# EAGLE board Sensormain_of_Tatebayashi (EAGLE 9.6.2)
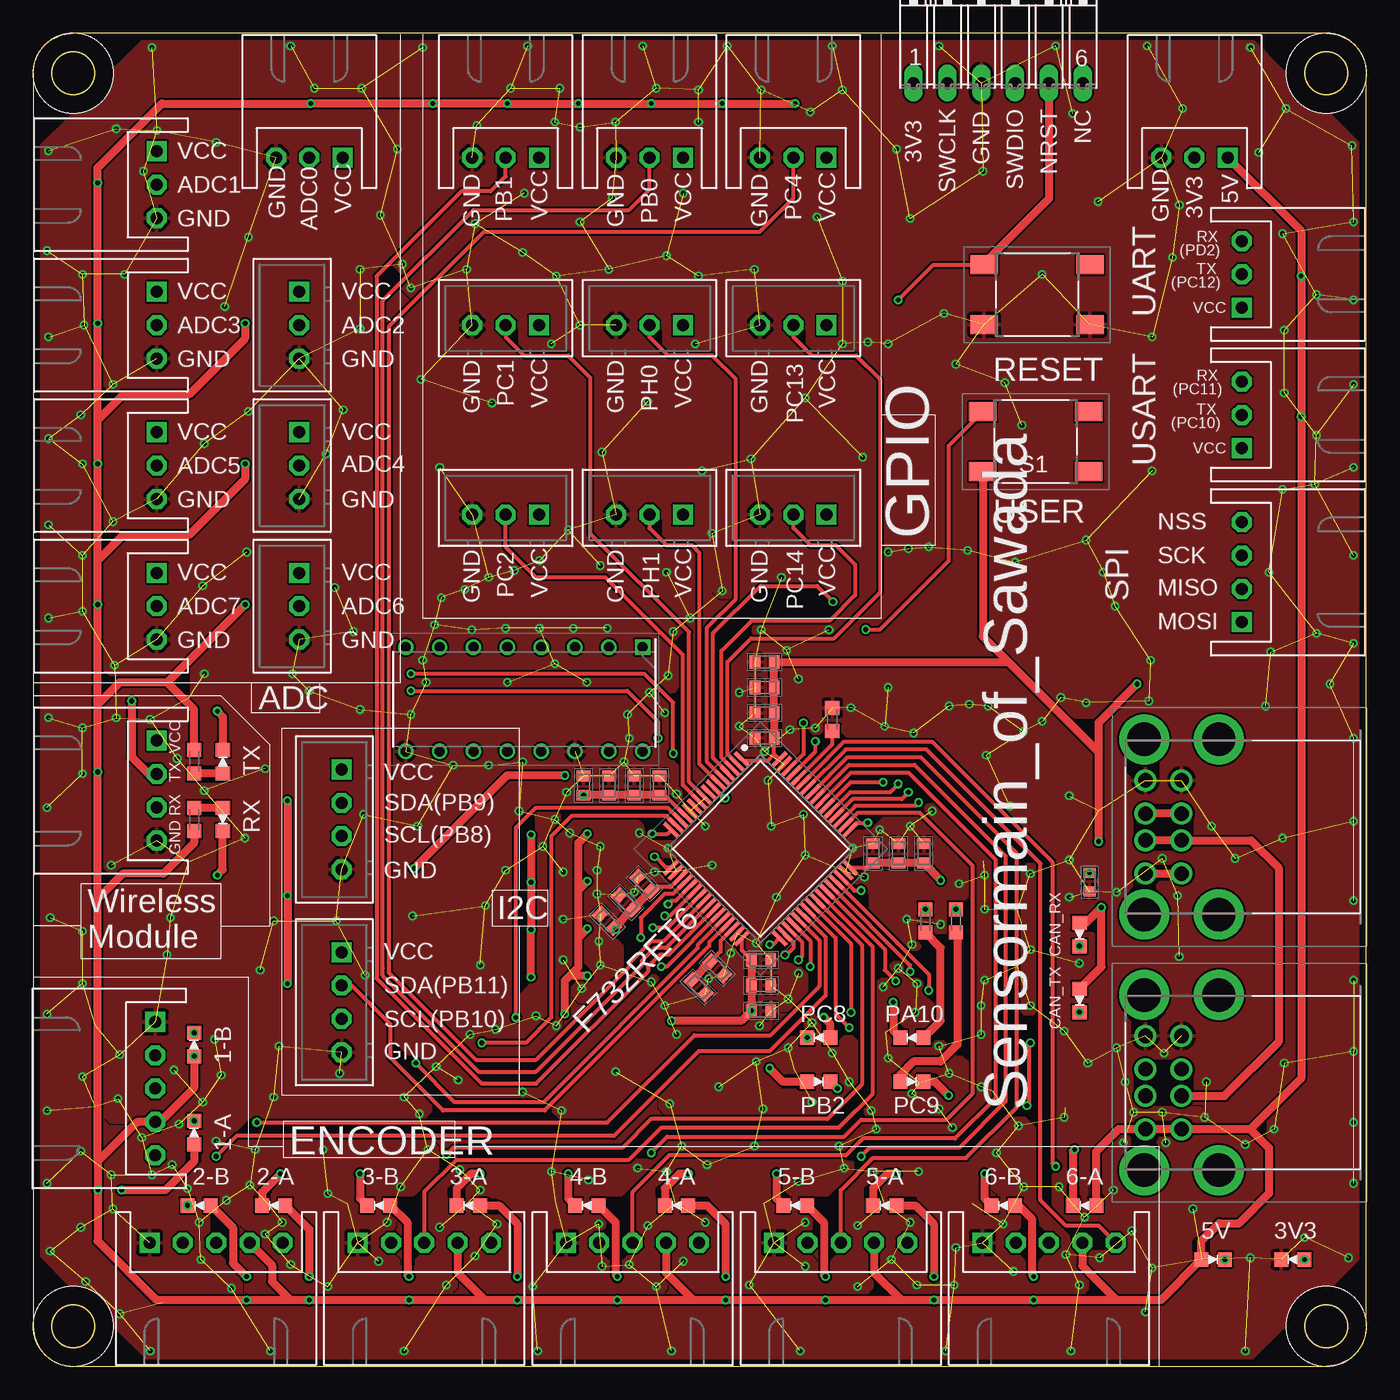
[diagram p5: board, top side]
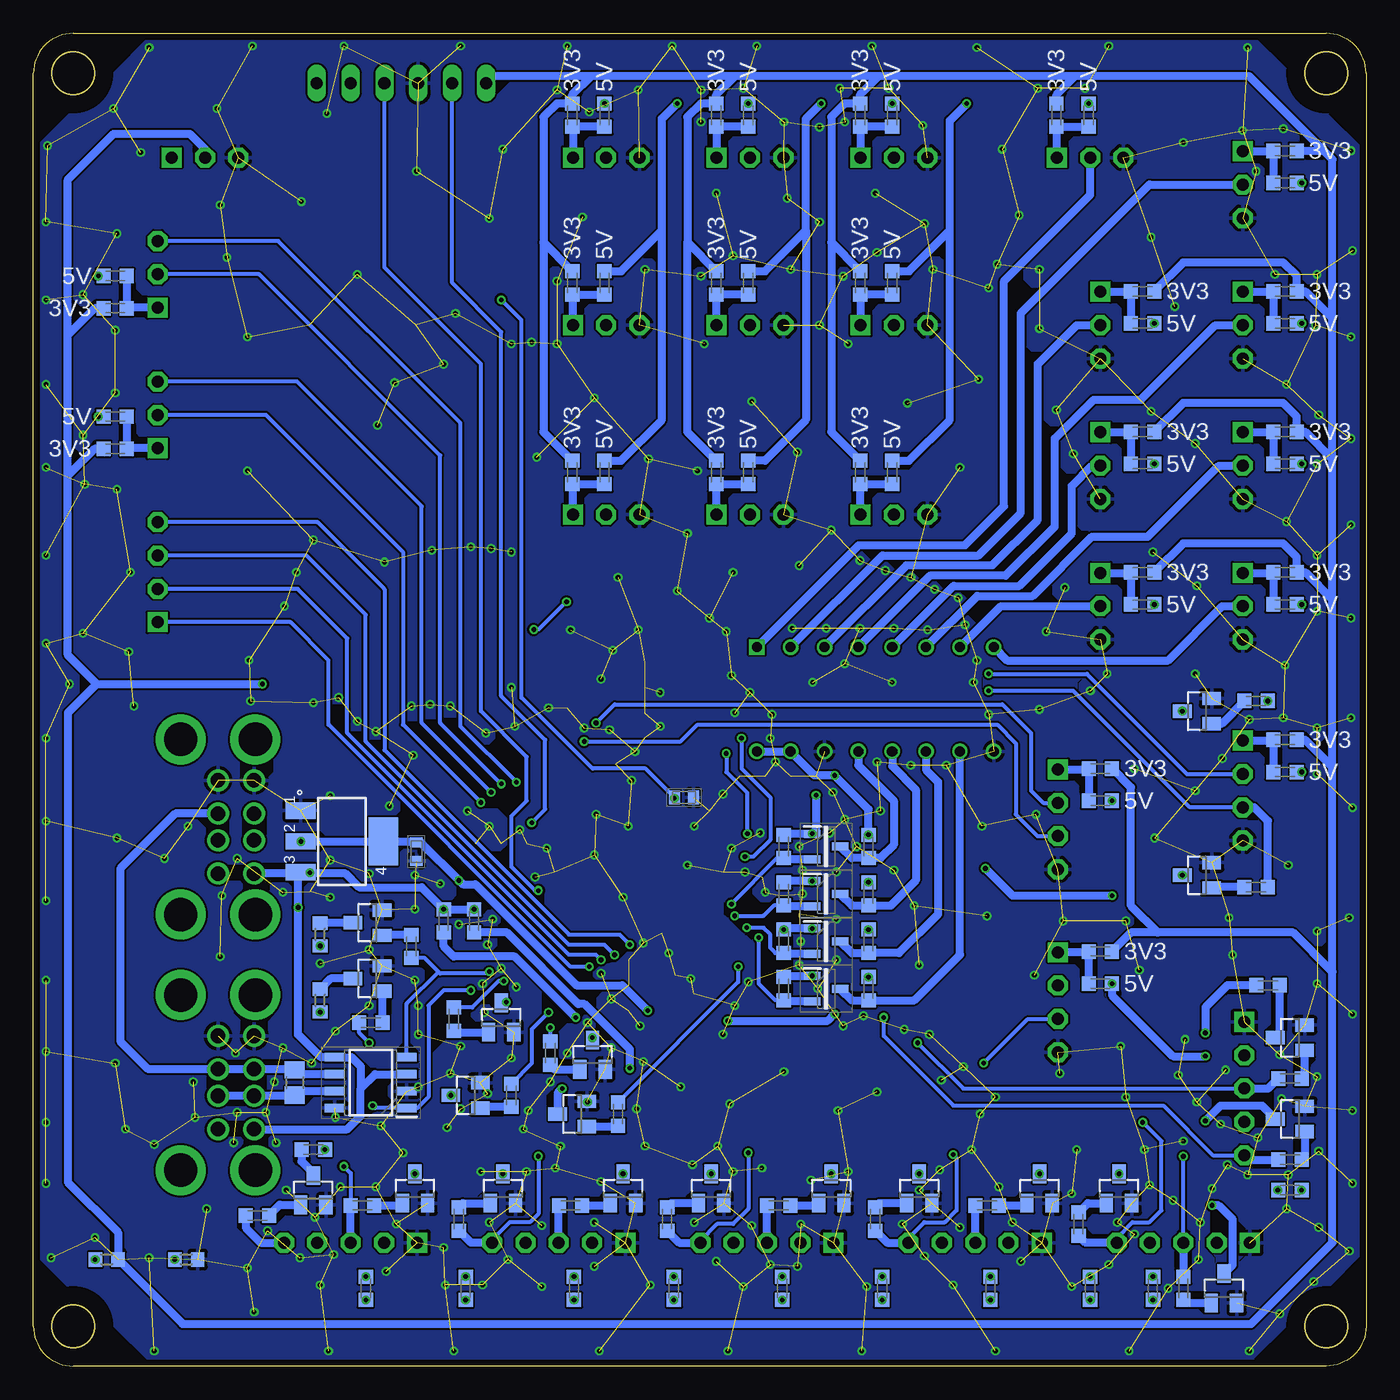
[diagram p6: board, bottom side, seen from below]

Size 100 x 100 mm. Coordinates in mm from the lower left corner, seen from the top.
Outline: 3,0 97,0 arc90 100,3 100,97 arc90 97,100 3,100 arc90 0,97 0,3 arc90 3,0
Outline: circle at 3,3 radius 1.6
Outline: circle at 97,3 radius 1.6
Outline: circle at 97,97 radius 1.6
Outline: circle at 3,97 radius 1.6
Copper layers (1*16): Top 0.035mm / dielectric 1.6mm / Bottom 0.035mm
Design rules "Elecrow_2-layer_PCB_eagle_rule": minimum track width 6mil, minimum drill 12mil, track to track 6mil, track to pad 6mil, pad to pad 6mil, via to via 8mil, smd to smd 0mil, copper to edge 20mil, drill to drill 10mil, minimum pad ring 6mil, minimum via ring 6mil, stop-mask expansion 0mil, vias tented up to drill 100mil, thermal gap 10mil
tRestrict: area 94,94 to 100,100; area 0,94 to 6,100; area 94,0 to 100,6; area 0,0 to 6,6; 323 lines
bRestrict: area 0,0 to 6,6; area 0,94 to 6,100; area 94,94 to 100,100; area 94,0 to 100,6; 480 lines

## Footprints (pad centres in the part's own frame; a part is rotated, then mirrored left to right if it is on the bottom)
CAPC1608X90N = smd 0.75 x 0.94: 1 -0.7,0; 2 0.7,0
CAPC1709X100N = smd 0.81 x 1.04: 1 -0.72,0; 2 0.72,0
QFP50P1200X1200X160-64N = smd 1.475 x 0.3: 1 -5.738,3.75; 2 -5.738,3.25; 3 -5.738,2.75; 4 -5.738,2.25; 5 -5.738,1.75; 6 -5.738,1.25; 7 -5.738,0.75; 8 -5.738,0.25; 9 -5.738,-0.25; 10 -5.738,-0.75; 11 -5.738,-1.25; 12 -5.738,-1.75; 13 -5.738,-2.25; 14 -5.738,-2.75; 15 -5.738,-3.25; 16 -5.738,-3.75; 33 5.738,-3.75; 34 5.738,-3.25; 35 5.738,-2.75; 36 5.738,-2.25; 37 5.738,-1.75; 38 5.738,-1.25; 39 5.738,-0.75; 40 5.738,-0.25; 41 5.738,0.25; 42 5.738,0.75; 43 5.738,1.25; 44 5.738,1.75; 45 5.738,2.25; 46 5.738,2.75; 47 5.738,3.25; 48 5.738,3.75 | smd 0.3 x 1.475: 17 -3.75,-5.738; 18 -3.25,-5.738; 19 -2.75,-5.738; 20 -2.25,-5.738; 21 -1.75,-5.738; 22 -1.25,-5.738; 23 -0.75,-5.738; 24 -0.25,-5.738; 25 0.25,-5.738; 26 0.75,-5.738; 27 1.25,-5.738; 28 1.75,-5.738; 29 2.25,-5.738; 30 2.75,-5.738; 31 3.25,-5.738; 32 3.75,-5.738; 49 3.75,5.738; 50 3.25,5.738; 51 2.75,5.738; 52 2.25,5.738; 53 1.75,5.738; 54 1.25,5.738; 55 0.75,5.738; 56 0.25,5.738; 57 -0.25,5.738; 58 -0.75,5.738; 59 -1.25,5.738; 60 -1.75,5.738; 61 -2.25,5.738; 62 -2.75,5.738; 63 -3.25,5.738; 64 -3.75,5.738
SOIC127P600X175-8N = smd 1.5 x 0.65: 1 -2.7,1.905; 2 -2.7,0.635; 3 -2.7,-0.635; 4 -2.7,-1.905; 5 2.7,-1.905; 6 2.7,-0.635; 7 2.7,0.635; 8 2.7,1.905
DIP781W56P254L1918H533Q16N = drill 0.759 pad 1.159 square: 1 -3.905,8.89 | drill 0.759 pad 1.159: 2 -3.905,6.35; 3 -3.905,3.81; 4 -3.905,1.27; 5 -3.905,-1.27; 6 -3.905,-3.81; 7 -3.905,-6.35; 8 -3.905,-8.89; 9 3.905,-8.89; 10 3.905,-6.35; 11 3.905,-3.81; 12 3.905,-1.27; 13 3.905,1.27; 14 3.905,3.81; 15 3.905,6.35; 16 3.905,8.89
USB4AF203AS = drill 1.1 pad 1.65: 1 0,0; 2 2.5,0; 3 4.5,0; 4 7,0; 5 0,-2.71; 6 2.5,-2.71; 7 4.5,-2.71; 8 7,-2.71 | drill 2.5 pad 3.75: MH1 -3.07,0.09; MH2 10.07,0.09; MH3 -3.07,-5.51; MH4 10.07,-5.51
LED1608 = smd 1.05 x 1.08: A -0.875,0; K 0.875,0
SOT96P237X111-3N = smd 1.25 x 0.6: 1 -1.05,0.955; 2 -1.05,-0.955; 3 1.05,0
SOT-23 = smd 1 x 1.4: 1 -0.95,-1.1; 2 0.95,-1.1; 3 0,1.1
1608 = smd 1.05 x 1.08: 1 -0.875,0; 2 0.875,0
R0603 = smd 1 x 1.1: 1 -0.85,0; 2 0.85,0
SMD1608 = smd 1.05 x 1.08: 1 -0.875,0; 2 0.875,0
R0805 = smd 1.3 x 1.5: 1 -0.95,0; 2 0.95,0
TSHAT25B219E = smd 2.05 x 1.4: A1 -3.975,2.25; B1 3.975,2.25; C1 -3.975,-2.25; D1 3.975,-2.25
06PA = drill 0.914 long: 1 -6.35,0; 2 -3.81,0; 3 -1.27,0; 4 1.27,0; 5 3.81,0; 6 6.35,0
SOT223 = smd 2.235 x 1.219: 1 -3.099,2.311; 2 -3.099,0; 3 -3.099,-2.311 | smd 2.2 x 3.6: 4 3.099,0
S5B-XH-A = drill 0.9 pad 1.5 square: 1 5,0 | drill 0.9 pad 1.5 octagon: 2 2.5,0; 3 0,0; 4 -2.5,0; 5 -5,0
B3B-XH-A = drill 0.9 pad 1.5 square: 1 2.5,0 | drill 0.9 pad 1.5 octagon: 2 0,0; 3 -2.5,0
S4B-XH-A = drill 0.9 pad 1.5 square: 1 3.75,0 | drill 0.9 pad 1.5 octagon: 2 1.25,0; 3 -1.25,0; 4 -3.75,0
S3B-XH-A = drill 0.9 pad 1.5 square: 1 2.5,0 | drill 0.9 pad 1.5 octagon: 2 0,0; 3 -2.5,0
B4B-XH-A = drill 0.9 pad 1.5 square: 1 3.75,0 | drill 0.9 pad 1.5 octagon: 2 1.25,0; 3 -1.25,0; 4 -3.75,0

## Placement (x,y rotation side)
C2  10uF  [CAPC1608X90N]  71.25,38.61 90 bottom
C3  100n  [CAPC1709X100N]  45.09,43.56 270 top
C4  1u  [CAPC1709X100N]  43.18,43.56 270 top
C5  100n  [CAPC1709X100N]  54.86,49.02 0 top
C6  100n  [CAPC1709X100N]  64.9,38.48 270 top
C7  100n  [CAPC1709X100N]  44.45,34.8 315 top
C8  100n  [CAPC1709X100N]  54.61,28.57 180 top
C9  100n  [CAPC1709X100N]  54.61,26.67 180 top
C10  100n  [CAPC1709X100N]  54.86,50.93 0 top
C11  100n  [CAPC1709X100N]  62.99,38.48 270 top
C12  100n  [CAPC1709X100N]  43.05,33.4 315 top
C13  100n  [CAPC1709X100N]  54.86,47.12 0 top
C14  100n  [CAPC1709X100N]  66.8,38.48 270 top
C15  100n  [CAPC1709X100N]  45.85,36.2 315 top
C16  100n  [CAPC1709X100N]  54.61,30.48 180 top
C17  4.7u  [CAPC1709X100N]  54.86,52.83 0 top
C18  100n  [CAPC1709X100N]  46.99,43.56 270 top
C19  1u  [CAPC1709X100N]  41.27,43.56 270 top
C20  2.2u  [CAPC1709X100N]  51.31,29.84 135 top
C21  2.2u  [CAPC1709X100N]  49.91,28.45 135 top
C22  100n  [CAPC1608X90N]  79.25,36.32 90 top
C23  0.1u  [CAPC1709X100N]  51.18,42.67 180 bottom
IC1  STM32F732RET6  [QFP50P1200X1200X160-64N]  54.57,38.82 315 top
IC2  NCV7351D1ER2G  [SOIC127P600X175-8N]  74.68,21.27 180 bottom
IC4  MCP3208-CI_P  [DIP781W56P254L1918H533Q16N]  36.83,50.04 270 top
J1  USB-4AF203AS  [USB4AF203AS]  83.44,36.96 90 top
J2  USB-4AF203AS  [USB4AF203AS]  83.44,17.78 90 top
LED1-G  LED1608  [LED1608]  48.26,12.06 180 top
LED2-R  LED1608  [LED1608]  94.49,8 180 top
LED3-R  LED1608  [LED1608]  88.52,8 0 top
LED4-G  LED1608  [LED1608]  63.88,12.06 180 top
LED5-G  LED1608  [LED1608]  78.87,12.06 180 top
LED6-Y  LED1608  [LED1608]  12.06,24.13 90 top
LED7-Y  LED1608  [LED1608]  12.45,12.06 180 top
LED8-Y  LED1608  [LED1608]  25.91,12.06 180 top
LED9-Y  LED1608  [LED1608]  41.53,12.06 180 top
LED10-Y  LED1608  [LED1608]  57.15,12.06 180 top
LED11-Y  LED1608  [LED1608]  72.77,12.06 180 top
LED12-G  LED1608  [LED1608]  14.22,45.34 90 top
LED13-Y  LED1608  [LED1608]  14.22,41.02 270 top
LED14-B  LED1608  [LED1608]  65.91,24.64 180 top
LED15-B  LED1608  [LED1608]  65.91,21.34 0 top
LED16-B  LED1608  [LED1608]  58.93,24.64 180 top
LED17-B  LED1608  [LED1608]  58.93,21.34 0 top
LED18-G  LED1608  [LED1608]  78.49,27.43 270 top
LED19-Y  LED1608  [LED1608]  78.49,32.38 270 top
LED20-G  LED1608  [LED1608]  12.06,17.53 90 top
LED21-G  LED1608  [LED1608]  18.03,12.06 180 top
LED23-G  LED1608  [LED1608]  32.64,12.06 180 top
Q1  BSS138LT7G  [SOT96P237X111-3N]  40.51,28.32 0 bottom
Q2  BSS138LT7G  [SOT96P237X111-3N]  40.51,31.88 0 bottom
Q3  BSS138LT7G  [SOT96P237X111-3N]  40.51,35.43 0 bottom
Q5  BSS138LT7G  [SOT96P237X111-3N]  40.51,38.99 0 bottom
Q9  SOT-23_NMOS  [SOT-23]  74.93,29.08 90 bottom
Q10  SOT-23_NMOS  [SOT-23]  74.93,33.27 90 bottom
R1  10k  [1608]  59.94,48.51 90 top
R2  1k  [R0603]  94.49,8 180 bottom
R3  1k  [R0603]  88.52,8 0 bottom
R4  10k  [SMD1608]  52.45,11.05 90 bottom
R5  120  [R0805]  80.39,21.29 270 bottom
R6  1k  [SMD1608]  51.94,5.84 90 bottom
R7  10k  [SMD1608]  68.07,11.05 90 bottom
R8  1k  [SMD1608]  67.56,5.84 90 bottom
R9  10k  [SMD1608]  83.19,11.3 0 bottom
R10  1k  [SMD1608]  78.99,16.26 180 bottom
R11  10k  [SMD1608]  5.71,21.59 0 bottom
R12  1k  [SMD1608]  7.37,28.57 0 bottom
R13  10k  [SMD1608]  13.72,5.84 270 bottom
R14  1k  [SMD1608]  16,5.84 90 bottom
R15  10k  [SMD1608]  28.45,12.06 0 bottom
R16  1k  [SMD1608]  28.19,5.84 90 bottom
R17  10k  [SMD1608]  44.07,12.06 0 bottom
R18  1k  [SMD1608]  43.81,5.84 90 bottom
R19  10k  [SMD1608]  59.69,12.06 0 bottom
R20  1k  [SMD1608]  59.44,5.84 90 bottom
R21  10k  [SMD1608]  75.31,12.06 0 bottom
R22  1k  [SMD1608]  75.06,5.84 90 bottom
R23  10k  [SMD1608]  43.69,28.32 270 bottom
R24  10k  [SMD1608]  37.34,28.32 270 bottom
R25  10k  [SMD1608]  43.69,31.88 270 bottom
R26  10k  [SMD1608]  37.34,31.88 270 bottom
R27  10k  [SMD1608]  43.69,35.43 270 bottom
R28  10k  [SMD1608]  37.34,35.43 270 bottom
R29  10k  [SMD1608]  43.69,38.99 270 bottom
R30  10k  [SMD1608]  37.34,38.99 270 bottom
R31  0  [SMD1608]  6.1,46.99 0 bottom
R32  0  [SMD1608]  6.1,44.58 0 bottom
R33  [SMD1608]  6.1,91.19 180 bottom
R34  [SMD1608]  6.1,88.77 180 bottom
R35  [SMD1608]  23.24,93.85 270 bottom
R36  [SMD1608]  20.83,93.85 270 bottom
R37  [SMD1608]  16.76,80.64 180 bottom
R38  [SMD1608]  16.76,78.23 180 bottom
R39  [SMD1608]  6.1,80.64 180 bottom
R40  [SMD1608]  6.1,78.23 180 bottom
R41  [SMD1608]  16.76,70.1 180 bottom
R42  [SMD1608]  16.76,67.69 180 bottom
R43  [SMD1608]  6.1,70.1 180 bottom
R44  [SMD1608]  6.1,67.69 180 bottom
R45  [SMD1608]  16.76,59.56 180 bottom
R46  [SMD1608]  16.76,57.15 180 bottom
R47  10k  [SMD1608]  5.71,15.49 0 bottom
R48  1k  [SMD1608]  5.71,13.21 180 bottom
R49  10k  [SMD1608]  21.59,10.67 90 bottom
R50  1k  [SMD1608]  20.7,5.84 90 bottom
R51  [SMD1608]  6.1,59.56 180 bottom
R52  [SMD1608]  6.1,57.15 180 bottom
R53  10k  [SMD1608]  36.83,11.05 90 bottom
R54  1k  [SMD1608]  36.32,5.84 90 bottom
R55  10k  [SMD1608]  8.26,49.91 180 bottom
R56  1k  [SMD1608]  12.06,45.34 270 top
R57  10k  [SMD1608]  8.26,35.94 180 bottom
R58  1k  [SMD1608]  12.06,41.02 90 top
R59  10k  [SMD1608]  68.45,26.04 270 bottom
R60  1k  [SMD1608]  66.93,33.4 270 top
R61  10k  [SMD1608]  64.14,20.32 270 bottom
R62  1k  [SMD1608]  69.22,33.4 270 top
R63  10k  [SMD1608]  61.21,23.5 270 bottom
R64  1k  [SMD1608]  69.22,33.4 270 bottom
R65  10k  [SMD1608]  56.13,18.92 270 bottom
R66  1k  [SMD1608]  66.93,33.4 270 bottom
R67  0  [SMD1608]  19.94,31.11 0 bottom
R68  0  [SMD1608]  19.94,28.7 0 bottom
R69  0  [SMD1608]  19.94,44.83 0 bottom
R70  0  [SMD1608]  19.94,42.42 0 bottom
R71  0  [SMD1608]  93.85,68.83 180 bottom
R72  0  [SMD1608]  93.85,71.25 180 bottom
R73  0  [SMD1608]  93.85,79.38 180 bottom
R74  0  [SMD1608]  93.85,81.79 180 bottom
R75  1k  [R0603]  78.49,27.43 90 bottom
R76  1k  [R0603]  78.49,32.38 90 bottom
R77  10k  [SMD1608]  74.68,25.78 180 bottom
R78  10k  [SMD1608]  71.63,31.5 270 bottom
R81  [SMD1608]  37.97,81.28 270 bottom
R82  [SMD1608]  35.56,81.28 270 bottom
R85  [SMD1608]  37.97,67.06 270 bottom
R86  [SMD1608]  35.56,67.06 270 bottom
R87  [SMD1608]  59.56,93.85 270 bottom
R88  [SMD1608]  57.15,93.85 270 bottom
R89  [SMD1608]  48.77,93.85 270 bottom
R90  [SMD1608]  46.35,93.85 270 bottom
R91  [SMD1608]  37.97,93.85 270 bottom
R92  [SMD1608]  35.56,93.85 270 bottom
R95  [SMD1608]  48.77,81.28 270 bottom
R96  [SMD1608]  46.35,81.28 270 bottom
R97  [SMD1608]  48.77,67.06 270 bottom
R98  [SMD1608]  46.35,67.06 270 bottom
R99  [SMD1608]  59.56,81.28 270 bottom
R100  [SMD1608]  57.15,81.28 270 bottom
R101  [SMD1608]  59.56,67.06 270 bottom
R102  [SMD1608]  57.15,67.06 270 bottom
S1  TSHA-T-2.5B2-19E  [TSHAT25B219E]  75.21,69.37 0 top
S2  TSHA-T-2.5B2-19E  [TSHAT25B219E]  75.31,80.39 0 top
SL1  [06PA]  72.39,96.27 0 top
TR1  2SC2712GR  [SOT-23]  49.15,13.34 0 bottom
TR2  2SC2712GR  [SOT-23]  64.77,13.34 0 bottom
TR3  2SC2712GR  [SOT-23]  78.99,13.21 0 bottom
TR4  2SC2712GR  [SOT-23]  5.71,24.64 90 bottom
TR5  2SC2712GR  [SOT-23]  10.67,5.84 0 bottom
TR6  2SC2712GR  [SOT-23]  24.51,13.34 0 bottom
TR7  2SC2712GR  [SOT-23]  40.13,13.34 0 bottom
TR8  2SC2712GR  [SOT-23]  55.75,13.34 0 bottom
TR9  2SC2712GR  [SOT-23]  71.37,13.34 0 bottom
TR10  2SC2712GR  [SOT-23]  12.7,49.15 90 bottom
TR11  2SC2712GR  [SOT-23]  12.7,36.83 90 bottom
TR12  2SC2712GR  [SOT-23]  64.9,26.16 0 bottom
TR13  2SC2712GR  [SOT-23]  67.56,20.32 90 bottom
TR14  2SC2712GR  [SOT-23]  58.04,23.37 0 bottom
TR15  2SC2712GR  [SOT-23]  5.71,18.54 90 bottom
TR16  2SC2712GR  [SOT-23]  18.54,13.34 0 bottom
TR17  2SC2712GR  [SOT-23]  59.56,18.92 90 bottom
TR21  2SC2712GR  [SOT-23]  33.53,13.34 0 bottom
U1  LD1117S33CTR  [SOT223]  76.83,39.37 0 bottom
X1  S5B-XH-A  [S5B-XH-A]  9.14,20.83 90 top
X2  S5B-XH-A  [S5B-XH-A]  13.72,9.27 180 top
X3  S5B-XH-A  [S5B-XH-A]  29.34,9.27 180 top
X4  S5B-XH-A  [S5B-XH-A]  44.96,9.27 180 top
X5  S5B-XH-A  [S5B-XH-A]  60.58,9.27 180 top
X6  S5B-XH-A  [S5B-XH-A]  76.2,9.27 180 top
X7  B3B-XH-A  [B3B-XH-A]  19.94,78.11 90 top
X8  S4B-XH-A  [S4B-XH-A]  90.68,59.56 270 top
X9  S4B-XH-A  [S4B-XH-A]  9.27,43.18 90 top
X10  B3B-XH-A  [B3B-XH-A]  19.94,67.56 90 top
X11  S3B-XH-A  [S3B-XH-A]  90.68,81.92 270 top
X12  S3B-XH-A  [S3B-XH-A]  20.7,90.68 0 top
X13  S3B-XH-A  [S3B-XH-A]  90.68,71.37 270 top
X14  B4B-XH-2  [B4B-XH-A]  23.11,41.02 90 top
X17  B4B-XH-2  [B4B-XH-A]  23.11,27.3 90 top
X18  S3B-XH-A  [S3B-XH-A]  9.27,67.56 90 top
X20  B3B-XH-A  [B3B-XH-A]  19.94,57.02 90 top
X21  S3B-XH-A  [S3B-XH-A]  9.27,57.02 90 top
X22  S3B-XH-A  [S3B-XH-A]  87.12,90.68 0 top
X23  S3B-XH-A  [S3B-XH-A]  9.27,78.11 90 top
X24  B3B-XH-A  [B3B-XH-A]  35.43,78.11 0 top
X25  S3B-XH-A  [S3B-XH-A]  9.27,88.65 90 top
X27  B3B-XH-A  [B3B-XH-A]  35.43,63.88 0 top
X28  S3B-XH-A  [S3B-XH-A]  57.02,90.68 0 top
X29  S3B-XH-A  [S3B-XH-A]  46.23,90.68 0 top
X30  S3B-XH-A  [S3B-XH-A]  35.43,90.68 0 top
X32  B3B-XH-A  [B3B-XH-A]  46.23,78.11 0 top
X33  B3B-XH-A  [B3B-XH-A]  46.23,63.88 0 top
X34  B3B-XH-A  [B3B-XH-A]  57.02,78.11 0 top
X35  B3B-XH-A  [B3B-XH-A]  57.02,63.88 0 top

## Tracks (layer width: path | path; a pad name or v marks a point on that pad's centre or on a via)
3V3  (via drill 0.35)
  Top 0.305: IC1.19 47.8,35.94 46.61,35.94 C15.2 | IC1.64 55.58,45.93 | 55.58,45.93 55.58,46.86 C13.2 | IC1.1 53.29,45.41 55.06,45.41 55.58,45.93 | IC1.48 62.65,37.42 C11.2 | C16.2 53.17,31.2 IC1.32 | IC1.13 47.37,42.84 C18.2
  Top 0.61: C15.2 C7.2 C12.2 43.56,32.88 R25.1 | C16.2 C8.2 C9.2 53.13,25.91 v47.88,25.91 | C11.2 C6.2 C14.2 68.07,36.49 v68.07,36.45 | 55.58,46.86 C5.2 C10.2 C17.2 73.15,52.83 | C18.2 C3.2 C4.2 C19.2 | Q5.1 40.89,39.27 40.89,35.72 | 40.89,32.16 40.89,29.95 40.23,29.28 | 40.89,32.16 40.89,35.72 | Q3.1 40.89,35.72 | Q2.1 40.89,32.16 | v39.88,26.42 39.88,28.93 40.23,29.28 | Q1.1 40.23,29.28 | 79.93,46.05 74.68,51.31 73.6,52.39 73.15,52.83 | U1.2 79.93,46.05 | 79.93,46.05 79.93,48.31 v82.8,51.18 | S1.C1 71.23,54.75 73.15,52.83
  Bottom 0.61: R29.1 43.61,39.94 Q5.1 41.27,40.23 C19.2 | R23.1 43.61,29.28 Q1.1 | Q2.1 43.61,32.83 R25.1 | Q3.1 43.61,36.39 R27.1 | 97.41,66.8 97.41,53.34 95.25,51.18 | 97.41,66.8 97.41,77.34 | 97.41,77.34 97.41,89.03 93.98,92.46 88.27,92.46 87.12,91.31 X22.2 | R73.2 95.38,79.38 97.41,77.34 | R71.2 95.38,68.83 97.41,66.8 | SL1.1 65.53,96.77 58.17,96.77 | v47.88,25.91 40.39,25.91 v39.88,26.42 | C9.2 55.8,28.57 59.26,28.57 66.83,36.15 67.77,36.15 v68.07,36.45 70.93,39.31 C2.2 71.31,39.37 U1.4 U1.2 | 95.25,51.18 97.41,49.02 97.41,13.8 93.64,10.03 R2.1 88.81,3.17 8.64,3.17 2.54,9.27 2.54,29.59 | 95.25,51.18 v82.8,51.18 | 2.54,29.59 2.54,44.96 | 2.54,44.96 2.54,57.53 | 2.54,57.53 2.54,68.07 | 2.54,68.07 2.54,78.61 | 2.54,78.61 2.54,90.55 3.17,91.19 | 21.84,96.77 8.76,96.77 3.17,91.19 | 21.84,96.77 36.58,96.77 | 36.58,96.77 47.37,96.77 | 47.37,96.77 58.17,96.77 | R31.2 4.57,46.99 2.54,44.96 | 2.54,57.53 4.57,59.56 R51.1 5.22,60.72 6.22,61.72 13.73,61.72 R45.1 | 2.54,68.07 4.57,70.1 R43.1 5.22,71.26 6.22,72.26 13.73,72.26 R41.1 | 2.54,78.61 4.57,80.64 R39.1 5.22,81.8 6.22,82.8 13.73,82.8 R37.1 | R33.1 3.17,91.19 | R35.1 23.24,95.38 21.84,96.77 | 36.58,96.77 37.97,95.38 R91.1 39.13,94.73 40.13,93.73 40.13,84.31 | 47.37,96.77 48.77,95.38 R89.1 49.92,94.73 50.93,93.73 50.93,84.31 | 58.17,96.77 59.56,95.38 R87.1 60.72,94.73 61.72,93.73 61.72,84.31 | R67.2 17.65,32.53 15.63,32.53 | R69.2 17.65,43.43 17.65,34.54 15.63,32.53 | 2.54,29.59 5.47,32.53 15.63,32.53 | R99.1 61.72,84.31 | 50.93,84.31 R95.1 | R81.1 40.13,84.31 | 40.13,84.31 40.13,70.09 R85.1 | R97.1 50.93,70.09 50.93,84.31 | 61.72,84.31 61.72,70.09 R101.1
  other vias: 41.56,29.28 41.56,39.94 41.56,32.83 41.56,36.39 43.69,32.75 41.27,42.84 53.89,26.67 79.93,39.37
5V  (via drill 0.35)
  Top 0.61: J1.1 J1.5 | 91.31,17.78 J2.5 J2.1 81.41,17.78 79.74,16.11 LED5-G.A | 91.31,17.78 95.12,21.59 v95.12,71.25 v95.12,81.79 95.12,85.18 X22.1 | 91.31,17.78 92.71,16.38 92.71,12.95 90.49,10.73 88.96,10.73 87.64,9.41 LED3-R.A 84.6,4.95 81.28,4.95 | 81.28,4.95 v75.06,4.95 v67.56,4.95 65.15,4.95 | 65.15,4.95 v59.44,4.95 v51.94,4.95 49.53,4.95 | 49.53,4.95 v43.81,4.95 v36.32,4.95 33.91,4.95 | 33.91,4.95 v28.19,4.95 v20.7,4.95 19.3,4.95 | 19.3,4.95 16,4.95 | 16,4.95 9.27,4.95 4.83,9.4 4.83,13.19 R48.1 4.83,13.22 4.83,15.37 | X6.4 78.7,7.53 81.28,4.95 | 4.83,15.37 7.79,18.33 X1.4 9.53,18.33 12.06,20.87 LED6-Y.A | X5.4 63.08,7.03 65.15,4.95 | X4.4 47.46,7.03 49.53,4.95 | X3.4 31.84,7.03 33.91,4.95 | R14.1 16,4.95 | X2.4 17.91,7.58 17.91,6.35 19.3,4.95 | R88.1 v51.69,94.73 R90.1 v40.89,94.73 R92.1 v29.97,94.73 R36.1 9.64,94.73 4.83,89.92 v4.83,88.77 v4.83,78.23 4.83,70.99 | R24.1 R26.1 R28.1 R30.1 | 4.83,15.37 4.83,35.05 | 4.83,35.05 v4.83,44.58 4.83,49.66 | 4.83,49.66 v4.83,57.15 4.83,60.45 | 4.83,60.45 v4.83,67.69 4.83,70.99 | R56.1 12.06,49.28 10.03,51.31 | 10.03,51.31 6.48,51.31 4.83,49.66 | R58.1 12.06,39.24 9.78,36.96 6.73,36.96 4.83,35.05 | R46.1 15.88,57.15 10.03,51.31 | R42.1 15.89,66.55 11.7,62.36 6.73,62.36 4.83,60.45 | R38.1 15.89,77.1 11.68,72.9 6.73,72.9 4.83,70.99 | R70.2 v19.06,35.31 R68.2 | v39.88,44.32 35.56,44.32 v28.57,37.34 | LED19-Y.A 78.98,33.26 v80.14,34.42 80.14,29.96 LED18-G.A
  Bottom 0.61: R22.1 v75.06,4.95 | R8.1 v67.56,4.95 | R20.1 v59.44,4.95 | R6.1 v51.94,4.95 | R18.1 v43.81,4.95 | R54.1 v36.32,4.95 | R16.1 v28.19,4.95 | R50.1 v20.7,4.95 | 80.01,36.96 76.58,36.96 75.55,35.93 70.87,35.93 R64.1 R66.1 | 80.01,36.96 J1.1 | v95.12,71.25 R72.2 | R74.2 v95.12,81.79 | IC4.16 IC4.15 43.18,46.1 41.4,44.32 v39.88,44.32 37.34,41.78 R30.1 | v4.83,88.77 R34.1 | R40.1 v4.83,78.23 | R44.1 v4.83,67.69 | R52.1 v4.83,57.15 | R32.2 v4.83,44.58 | R68.2 19.06,27.83 14.49,23.25 LED6-Y.A | R100.1 55.89,82.16 52.83,85.22 | 52.83,85.22 52.83,93.6 51.7,94.73 v51.69,94.73 | R96.1 45.1,82.16 42.04,85.22 | v40.89,94.73 42.04,93.58 42.04,85.22 | R82.1 34.3,82.16 31.24,85.22 | v29.97,94.73 31.24,93.46 31.24,85.22 | R86.1 34.3,67.93 31.24,70.99 31.24,85.22 | 42.04,85.22 42.04,70.99 45.1,67.93 R98.1 | R102.1 55.89,67.93 52.83,70.99 52.83,85.22 | v28.57,37.34 26.54,35.31 v19.06,35.31 | C22.2 79.28,37.06 U1.3 80.01,36.98 80.01,36.96 | 80.01,36.96 80.14,36.83 v80.14,34.42 80.14,24.89 78.42,23.18 IC2.5 76.14,23.18 75.44,22.48 75.44,20.83 | 75.44,20.83 75.44,18.8 76.45,17.78 J2.1 | 75.44,20.83 74.36,21.91 IC2.3
  other vias: 16,4.97 4.84,13.21 66.93,34.28 69.22,34.28 37.34,29.2 37.34,32.75 37.34,36.31 37.34,39.86 57.15,94.73 46.35,94.73 35.56,94.73 20.83,94.73 15.89,57.15 15.89,67.69 15.89,78.23 12.06,23.25 19.06,42.42 19.06,28.7 79.25,37.02
ADC0
  Bottom 0.61: IC4.1 38.07,61.59 30.1,61.59 27.18,64.52 27.18,81.41 20.7,87.88 X12.2
ADC1
  Bottom 0.61: IC4.2 36.29,60.83 29.08,60.83 25.91,64.01 25.91,78.99 16.26,88.65 X25.2
ADC2
  Bottom 0.61: IC4.3 34.51,60.07 28.07,60.07 24.64,63.5 24.64,75.18 21.72,78.11 X7.2
ADC3
  Bottom 0.61: X23.2 11.3,78.11 16.89,72.52 20.45,72.52 23.37,69.6 23.37,62.99 27.05,59.31 32.73,59.31 IC4.4
ADC4
  Bottom 0.61: IC4.5 30.96,58.55 26.04,58.55 22.1,62.48 22.1,66.04 20.57,67.56 X10.2
ADC5
  Bottom 0.61: X18.2 11.05,67.56 16.38,62.23 20.57,62.23 25.02,57.78 29.18,57.78 IC4.6
ADC6
  Bottom 0.61: IC4.7 27.4,57.02 X20.2
ADC7
  Bottom 0.61: IC4.8 26.96,52.96 14.86,52.96 10.79,57.02 X21.2
CAN_RX  (via drill 0.35)
  Top 0.305: v65.79,29.59 65.79,30.09 IC1.44
  Bottom 0.305: IC2.4 71.98,27.21 69.6,29.59 | v65.79,29.59 65.91,29.46 69.47,29.46 69.6,29.59 | 69.6,29.59 70.63,30.62 R78.2
CAN_TX  (via drill 0.35)
  Top 0.305: IC1.45 64.83,31.75 67.18,29.39 v67.18,28.19 | v74.8,24.26 74.68,24.13 74.68,19.68 v74.55,19.56
  Bottom 0.305: v67.18,28.19 69.22,28.19 70.36,27.05 70.36,20.19 71.18,19.37 IC2.1 74.36,19.37 v74.55,19.56 | v74.8,24.26 75.55,25 R77.2
CANH
  Top 0.61: J1.2 J1.6 91.35,39.46 93.47,37.34 93.47,24.38 89.37,20.28 J2.6
  Bottom 0.61: IC2.7 80.09,20.64 R5.2 80.45,20.28 J2.2 J2.6
CANL
  Top 0.61: J1.7 J1.3
  Bottom 0.61: IC2.6 80.06,21.91 R5.1 80.44,22.28 J2.3 J2.7 91.37,22.28 93.47,24.38 93.47,37.34 89.35,41.46 J1.7
ENCODER1-A  (via drill 0.35)
  Top 0.305: IC1.14 47.63,41.88 37.69,41.88 36.2,40.39 v36.2,26.16
  Bottom 0.305: X1.5 11.51,15.83 15.24,19.55 30.98,19.55 36.2,24.77 v36.2,26.16
  Bottom 0.61: X1.5 8.81,15.49 R47.1
ENCODER1-B  (via drill 0.35)
  Top 0.305: IC1.15 47.52,41.27 40.39,41.27 38.86,39.75 38.86,26.16 36.96,24.26 v33.66,24.26
  Bottom 0.305: v33.66,24.26 30.23,20.83 X1.3
  Bottom 0.61: X1.3 7.35,20.83 R11.1
ENCODER2-A  (via drill 0.35)
  Top 0.305: IC1.37 58.98,31.94 58.98,28.5 55.31,24.83 49.59,24.83 43.05,18.29 v16.76,18.29
  Bottom 0.305: X2.5 18.72,9.61 17.53,10.79 16.26,10.79 15.37,11.68 15.37,16.89 v16.76,18.29
  Bottom 0.61: X2.5 21.07,9.27 R49.1
ENCODER2-B  (via drill 0.35)
  Top 0.305: IC1.38 59.44,32.19 59.44,27.81 55.24,23.62 49.91,23.62 43.56,17.27 15.24,17.27 v13.72,15.75
  Bottom 0.305: X2.3 v13.72,15.75
  Bottom 0.61: X2.3 R13.1
ENCODER3-A  (via drill 0.35)
  Top 0.305: IC1.41 62.15,31.6 62.15,21.13 59.56,18.54 46.35,18.54 44.2,16.38 31.5,16.38 v30.99,15.88
  Bottom 0.305: X3.5 34.34,9.61 33.15,10.79 31.62,10.79 30.73,11.68 30.73,15.62 v30.99,15.88
  Bottom 0.61: R53.1 35.93,9.27 X3.5
ENCODER3-B
  Top 0.305: IC1.42 62.99,31.46 62.99,20.45 60.45,17.91 47.12,17.91 44.7,15.49 31.75,15.49 29.34,13.08 X3.3
  Bottom 0.61: X3.3 29.34,12.05 R15.1
ENCODER4-A  (via drill 0.35)
  Top 0.305: IC1.50 61.87,41.53 66.49,41.53 70.45,37.57 70.45,20.42 68.52,18.49 62.1,18.49 60.82,17.21 47.56,17.21 v46.35,16
  Bottom 0.305: v46.35,16 46.35,11.81 47.5,10.67 48.69,10.67 49.96,9.4 X4.5
  Bottom 0.61: R4.1 51.55,9.27 X4.5
ENCODER4-B
  Top 0.305: IC1.55 61.34,44.53 65.66,44.53 72.18,38.01 72.18,20.11 69.15,17.08 62.23,17.08 60.96,15.81 47.69,15.81 44.96,13.08 X4.3
  Bottom 0.61: X4.3 44.94,9.29 R17.1
ENCODER5-A  (via drill 0.35)
  Top 0.305: IC1.56 61.21,45.11 66.11,45.11 72.95,38.27 72.95,19.86 69.47,16.38 62.74,16.38 v62.1,15.75
  Bottom 0.305: X5.5 65.58,9.48 64.26,10.79 62.74,10.79 62.1,11.43 v62.1,15.75
  Bottom 0.61: X5.5 67.17,9.27 R7.1
ENCODER5-B
  Top 0.305: IC1.57 61.09,45.7 66.55,45.7 73.79,38.46 73.79,19.43 69.98,15.62 62.99,15.62 60.58,13.21 X5.3
  Bottom 0.61: X5.3 60.58,12.05 R19.1
ENCODER6-A
  Top 0.305: X6.5 79.93,10.54 77.47,10.54 75.56,12.45 75.56,37.71 66.99,46.28 60.97,46.28 IC1.58
  Bottom 0.61: R9.1 84.06,10.4 82.93,9.27 X6.5
ENCODER6-B  (via drill 0.35)
  Top 0.305: IC1.59 58.42,44.44 58.42,44.45 60.83,46.86 67.44,46.86 76.45,37.85 76.45,15.24 v76.71,14.99
  Bottom 0.305: v76.71,14.99 v76.71,15 76.19,14.48 R21.1
  Bottom 0.61: X6.3 R21.1
GND  (via drill 0.35)  (533 unrouted)
  other vias: 1.27,8.64 3.94,6.35 6.48,3.94 8.76,1.14 17.78,1.14 27.81,1.14 37.85,1.14 47.88,1.14 57.53,1.14 68.45,1.14 77.85,1.14 99.06,13.72 99.06,18.29 99.06,23.62 99.06,28.96 99.06,34.92 99.06,40.89 99.06,47.12 99.06,54.23 99.06,60.83 99.06,67.44 99.06,73.66 99.06,80.01 99.06,85.85 98.93,91.57 93.98,94.36 91.31,98.93 83.57,99.06 76.71,99.06 67.94,99.06 1.02,26.42 1.02,19.18 1.02,13.72 5.97,11.81 12.57,8 12.45,10.79 11.56,13.34 13.72,16.89 5.84,14.35 8.89,14.35 10.41,15.11 8.13,17.14 10.92,18.16 12.7,19.81 18.41,24 13.59,24.51 10.54,22.23 6.35,20.07 6.48,23.37 14.86,5.84 17.4,9.91 19.3,7.62 22.1,5.97 18.67,10.79 14.48,12.45 16.64,16.26 21.72,16.26 29.59,16.26 47.75,19.68 22.1,12.95 27.56,13.46 30.48,10.41 26.54,10.79 25.91,7.87 30.99,6.1 33.15,8.26 34.8,10.67 33.53,13.21 32,14.73 38.86,14.61 41.66,13.97 45.34,14.86 42.42,10.67 42.67,7.49 44.7,7.62 46.1,10.54 46.74,5.97 48.77,7.87 50.42,10.79 53.72,6.1 37.47,5.97 47.5,14.61 50.55,15.11 60.83,14.86 57.4,13.84 57.91,10.79 57.91,7.49 61.85,5.97 61.85,10.54 62.99,14.61 65.79,10.79 64.39,8 66.29,6.1 66.42,14.61 69.22,8.89 69.09,6.1 72.77,10.67 72.26,16 73.91,18.03 74.3,13.46 77.47,8.38 78.49,6.1 73.53,7.11 80.01,8.13 76.96,13.46 77.34,25.15 81.92,21.34 82.55,19.05 78.87,11.18 81.79,16.76 84.96,16.76 81.03,13.21 82.42,10.16 83.95,7.37 90.93,16.64 87.88,18.67 85.98,30.73 85.85,35.31 84.71,38.1 90.17,38.1 93.73,39.62 93.73,65.79 93.85,77.72 93.73,84.96 85.98,87.12 86.23,94.36 77.98,93.98 75.69,81.92 77.72,35.18 62.87,19.18 67.94,19.3 68.71,21.97 64.14,23.11 67.94,24 66.17,26.54 63.75,28.45 66.29,28.7 65.91,31.62 64.9,29.84 48.64,16.51 54.1,16.51 60.45,16.51 63.25,17.78 68.96,17.91 71.12,20.95 71.12,24.89 71.12,27.05 71.37,28.96 65.91,20.45 65.53,33.53 68.07,33.15 65.79,40.51 61.47,38.86 63.5,40.26 62.36,36.7 67.44,41.66 83.82,52.96 59.94,23.5 56.64,23.88 58.42,25.78 61.21,21.34 54.23,22.86 58.42,19.81 51.44,20.95 47.37,27.05 52.32,30.99 54.23,31.75 57.4,29.46 56.64,27.56 54.48,25.53 48.26,24.89 39.62,19.18 43.69,22.1 50.67,29.08 42.42,31.88 46.61,37.08 45.09,35.56 42.29,35.43 42.55,30.1 41.15,28.32 39.24,25.53 37.72,26.29 39.75,30.48 39.75,33.53 39.75,37.08 40.26,40.01 42.55,38.99 45.47,40.01 47.62,38.86 42.29,37.21 38.23,38.99 39.12,41.02 50.42,40.51 55.12,43.94 52.96,48.01 54.86,46.1 52.96,50.55 71.25,89.66 64.77,91.31 79.88,87.38 68.33,78.99 83.95,77.22 83.95,67.18 58.67,47.88 56.77,47.75 30.23,22.48 46.35,28.83 36.7,20.57 22.99,21.97 3.56,10.41 3.68,21.72 3.68,28.7 3.56,16.13 16.26,13.59 83.44,4.06 84.71,19.05 84.84,23.5 81.28,35.56 54.74,19.3 63.88,48.01 66.04,47.5 68.71,49.53 70.23,49.66 71.63,49.53 70.1,61.21 67.18,61.47 65.66,61.34 64.14,61.09 64.14,50.93 64.14,76.71 69.22,75.18 72.9,73.79 74.17,70.61 73.66,60.33 71.5,45.85 74.3,47.62 81.15,57.02 80.26,59.56 78.99,61.98 92.71,59.56 55.37,40.51 55.75,35.18 50.93,37.59 57.91,38.35 96.27,69.85 93.85,73.03 96.27,80.39 85.47,83.19 91.95,91.06 65.79,86.11 78.99,49.78 92.46,49.53 69.47,36.2 77.72,42.8 96.14,66.17 28.96,18.92 91.31,8.13 87,11.81 93.09,17.78 95.38,9.65 90.93,1.14 98.68,8.13 77.72,37.97 73.28,42.04 75.69,48.39 77.09,50.16 97.28,51.18 92.84,53.59 96.27,54.99 60.71,95.76 58.29,94.11 54.61,95.76 58.8,86.23 60.71,81.41 54.1,82.3 60.71,76.71 57.91,72.64 62.61,76.83 62.23,68.2 53.85,68.07 56.13,59.18 50.93,62.48 47.5,59.56 40.13,62.74 43.05,55.37 37.97,60.45 36.07,59.69 40.51,55.37 37.97,55.37 34.16,59.18 32.38,58.29 35.43,55.37 32.89,55.24 30.61,57.66 30.1,55.63 18.03,20.19 27.81,20.19 31.88,21.46 34.67,25.27 49.91,95.76 46.74,95.89 39.5,95.89 35.81,95.89 24.64,95.89 49.91,93.34 43.69,93.34 48.77,88.01 41.02,85.85 41.02,92.96 43.43,87.63 47.5,83.31 49.91,81.79 43.18,82.3 49.66,76.71 46.1,72.39 50.16,67.18 42.67,68.58 41.02,78.11 30.48,67.44 29.08,74.04 28.32,80.9 27.69,82.68 26.04,86.36 27.3,91.31 33.27,93.09 39.12,93.34 36.83,88.01 33.15,85.72 36.7,83.57 39.24,81.79 32.51,82.3 38.86,76.71 34.42,72.26 21.08,95.89 6.22,92.84 13.72,91.82 24.51,82.3 24.51,77.85 23.24,71.75 21.97,68.45 14.35,79.5 3.68,81.92 16.13,84.71 3.81,78.11 3.56,71.37 16.13,71.63 12.83,69.22 3.68,67.69 16,61.09 22.61,58.42 3.68,60.83 3.68,56.64 3.68,47.88 12.7,58.55 24,55.12 29.21,52.96 19.43,51.94 47.62,51.82 39.12,52.7 24.51,49.28 20.7,50.67 12.83,43.18 6.1,52.58 6.22,48.64 10.79,45.59 3.68,44.45 3.68,32.64 10.29,33.66 15.88,39.62 17.4,44.83 18.03,33.4 28.83,40.51 31.5,45.09 34.16,45.09 36.7,45.34 36.45,41.66 35.43,37.21 33.91,34.54 33.53,30.1 28.45,33.78 22.73,33.4 17.02,29.72 10.03,30.86 14.1,21.84 44.58,48.9 24.77,41.4 28.32,48.9 83.69,49.91 71.37,36.83 32.77,24.89 48.26,42.93 44.7,47.12 24.89,29.34 9.27,92.71 8.26,89.66 5.97,73.66 6.86,81.92 5.97,63.37 12.83,51.94 5.84,37.59 8.76,48.51 49.28,56.13 42.55,60.07 48.01,55.12 51.69,58.17 54.61,55.24 59.69,55.24 56.52,53.72 57.4,51.56 40.01,43.05 59.94,99.06 52.07,99.06 45.72,99.06 37.08,99.06 29.21,98.93 19.3,99.06 8.89,98.93 1.14,91.19 1.02,83.69 1.14,77.22 1.14,69.6 1.14,63.12 1.14,56.13 1.14,48.64 1.02,41.91 1.27,33.66 78.49,30.23 71.37,34.29 74.8,36.96 74.8,31.24 74.8,27.05 29.46,51.31 35.56,51.31 41.53,51.31 46.23,50.55 44.32,45.34 47.37,49.02 61.34,49.4 57.78,41.4 81.28,23.88 77.34,18.67 88.39,40.51 93.85,22.73 88.01,21.34 79.12,22.73
  pour Top: -0.13,100.2 100.2,100.2 100.2,-0.13 -0.13,-0.13
  pour Bottom: -0.13,100.2 100.2,100.2 100.2,-0.13 -0.13,-0.13
MISO_5V
  Bottom 0.61: Q3.3 38.59,34.56 R28.2 37.32,34.54 35.69,34.54 33.78,36.45 33.78,43.24 35.56,45.02 IC4.12
MOSI_5V
  Bottom 0.61: Q2.3 38.59,31 R26.2 35.04,31 32.13,33.91 32.13,43.85 33.02,44.74 IC4.11
N$1  (via drill 0.35)
  Bottom 0.61: TR15.3 7.81,19.54 10.93,19.54 LED20-G.K
  other vias: 12.06,18.4
N$2  (via drill 0.35)
  Top 0.61: LED20-G.A 12.06,15.37 9.91,13.21 v6.63,13.21
  Bottom 0.61: v6.63,13.21 R48.2
N$3
  Bottom 0.61: R49.2 20.9,12.23 TR16.1
N$4
  Bottom 0.61: TR15.1 4.62,15.72 R47.2
N$5  (via drill 0.35)
  Top 0.61: TR16.3 17.16,13.05 LED21-G.K
  other vias: 18.54,14.44
N$6  (via drill 0.35)
  Top 0.61: R50.2 20.7,10.27 LED21-G.A
  other vias: 20.7,6.72
N$7  (via drill 0.35)
  Bottom 0.61: R2.2 LED2-R.A
  other vias: 95.36,8
N$8  (via drill 0.35)
  Bottom 0.61: LED3-R.K R3.1
  other vias: 89.39,8
N$9
  Bottom 0.61: TR1.1 52.14,12.23 R4.2
N$10
  Bottom 0.61: TR21.1 36.52,12.23 R53.2
N$11  (via drill 0.35)
  Top 0.61: TR1.3 48.47,14.44 47.38,13.35 LED1-G.K
  other vias: 49.15,14.44
N$12  (via drill 0.35)
  Top 0.61: LED1-G.A 50.55,12.06 51.94,10.67 R6.2
  other vias: 51.94,6.72
N$13  (via drill 0.35)
  Top 0.61: TR21.3 32.85,14.44 31.76,13.35 LED23-G.K
  other vias: 33.53,14.44
N$14
  Bottom 0.61: R7.2 67.76,12.23 TR2.1
N$15
  Top 0.305: IC1.60 59.94,46.67 R1.1
N$16  (via drill 0.35)
  Top 0.61: TR2.3 64.09,14.44 63.01,13.35 LED4-G.K
  other vias: 64.77,14.44
N$17  (via drill 0.35)
  Top 0.61: LED4-G.A 66.17,12.06 67.56,10.67 R8.2
  other vias: 67.56,6.72
N$18
  Bottom 0.61: R9.2 81.5,12.11 TR3.1
N$19  (via drill 0.35)
  Top 0.61: R10.1 77.99,16.13 LED5-G.K
  other vias: 78.12,16.26
N$20
  Bottom 0.61: TR3.3 78.99,14.49 79.87,15.37 R10.2
N$21
  Bottom 0.61: R11.2 4.62,21.82 TR4.1
N$22  (via drill 0.35)
  Bottom 0.61: R12.1 10.41,28.57 12.06,26.92 LED6-Y.K
  other vias: 12.06,25
N$23
  Bottom 0.61: TR4.3 6.49,24.96 R12.2
N$24  (via drill 0.35)
  Top 0.61: LED23-G.A 34.92,12.06 36.32,10.67 R54.2
  other vias: 36.32,6.72
N$25
  Bottom 0.61: R13.2 13.49,4.74 TR5.1
N$26  (via drill 0.35)
  Bottom 0.61: TR5.3 10.01,7.6 10.01,11.01 11.06,12.06 LED7-Y.K
  other vias: 11.57,12.06
N$27  (via drill 0.35)
  Top 0.61: LED7-Y.A 14.99,10.4 14.99,7.73 R14.2
  other vias: 16,6.72
N$28
  Bottom 0.61: R15.2 25.63,12.06 TR6.1
N$29  (via drill 0.35)
  Top 0.61: TR6.3 24.51,12.59 LED8-Y.K
  other vias: 24.51,14.44
N$30  (via drill 0.35)
  Top 0.61: LED8-Y.A 28.07,10.78 28.07,6.84 R16.2
  other vias: 28.19,6.72
N$31
  Bottom 0.61: R17.2 41.25,12.06 TR7.1
N$32  (via drill 0.35)
  Top 0.61: TR7.3 40.13,12.59 LED9-Y.K
  other vias: 40.13,14.44
N$33  (via drill 0.35)
  Top 0.61: LED9-Y.A 43.69,10.78 43.69,6.84 R18.2
  other vias: 43.81,6.72
N$34
  Bottom 0.61: R19.2 56.87,12.06 TR8.1
N$35  (via drill 0.35)
  Top 0.61: TR8.3 55.75,12.59 LED10-Y.K
  other vias: 55.75,14.44
N$36  (via drill 0.35)
  Top 0.61: LED10-Y.A 59.31,10.78 59.31,6.84 R20.2
  other vias: 59.44,6.72
N$37
  Bottom 0.61: R21.2 72.49,12.06 TR9.1
N$38  (via drill 0.35)
  Top 0.61: LED11-Y.A 73.91,12.06 74.93,11.05 74.93,6.84 R22.2
  other vias: 75.06,6.72
N$39  (via drill 0.35)
  Top 0.61: TR9.3 71.37,12.59 LED11-Y.K
  other vias: 71.37,14.44
N$40
  Bottom 0.61: R55.2 10.84,48.2 TR10.1
N$41
  Bottom 0.61: X9.1 7.03,46.93 R31.1 R32.1
N$42
  Bottom 0.61: X25.1 7.01,91.15 R33.2 R34.2
N$43
  Bottom 0.61: X12.1 23.2,92.94 R35.2 R36.2
N$44
  Bottom 0.61: X7.1 17.68,80.61 R37.2 R38.2
N$45
  Bottom 0.61: X23.1 7.01,80.61 R39.2 R40.2
N$46
  Bottom 0.61: X10.1 17.68,70.06 R41.2 R42.2
N$47
  Bottom 0.61: X18.1 7.01,70.06 R43.2 R44.2
N$48
  Bottom 0.61: X20.1 17.68,59.52 R45.2 R46.2
N$49
  Bottom 0.61: X21.1 7.01,59.52 R51.2 R52.2
N$50  (via drill 0.35)
  Top 0.61: TR10.3 14.22,48.73 LED12-G.K
  other vias: 13.8,49.15
N$51
  Top 0.61: LED12-G.A R56.2
N$52
  Bottom 0.61: R57.2 11.54,35.94 TR11.1
N$53  (via drill 0.35)
  Top 0.61: TR11.3 14.22,37.25 LED13-Y.K
  other vias: 13.8,36.83
N$54
  Top 0.61: LED13-Y.A R58.2
N$55
  Bottom 0.61: R59.2 68.36,25.06 TR12.1
N$56  (via drill 0.35)
  Top 0.61: v64.52,27.3 64.52,25.16 LED14-B.K
  Bottom 0.61: TR12.3 64.56,27.26 v64.52,27.3
N$57
  Top 0.61: LED14-B.A 68.07,25.92 68.07,31.38 R60.2
N$58
  Bottom 0.61: R61.2 66.39,19.45 TR13.1
N$59  (via drill 0.35)
  Top 0.61: TR13.3 67.65,21.34 LED15-B.K
  other vias: 68.66,20.32
N$60
  Top 0.61: R62.2 69.34,32.4 69.34,24.13 68.07,22.86 66.04,22.86 65.04,21.86 LED15-B.A
N$61
  Bottom 0.61: R63.2 60.86,22.27 TR14.1
N$62  (via drill 0.35)
  Bottom 0.61: LED16-B.K 58.05,24.48 TR14.3
  other vias: 58.05,24.64
N$63  (via drill 0.35)
  Top 0.61: LED16-B.A 59.8,25.67 v59.31,26.16
  Bottom 0.61: R64.2 69.22,31.5 68.45,30.73 63.88,30.73 v59.31,26.16
N$64
  Bottom 0.61: R65.2 56.21,17.97 TR17.1
N$65  (via drill 0.35)
  Top 0.61: LED17-B.K 59.82,21.34 v60.33,20.83
  Bottom 0.61: v60.33,20.83 60.66,20.49 TR17.3
N$66  (via drill 0.35)
  Top 0.61: LED17-B.A 56.26,21.34 v55.24,22.35
  Bottom 0.61: v55.24,22.35 55.24,23.78 58.65,27.18 59.12,27.18 64.47,32.53 R66.2
N$67
  Bottom 0.61: X14.1 20.87,44.77 R69.1 R70.1
N$68
  Bottom 0.61: R68.1 R67.1 20.87,31.05 X17.1
N$69
  Bottom 0.61: X13.1 92.94,68.87 R71.1 R72.1
N$70
  Bottom 0.61: X11.1 92.94,79.42 R73.1 R74.1
N$71
  Bottom 0.61: Q9.1 73.83,25.81 R77.1
N$72
  Bottom 0.61: R78.1 73.78,32.37 Q10.1
N$73  (via drill 0.35)
  Bottom 0.61: R75.1 LED18-G.K
  other vias: 78.49,26.56
N$74
  Bottom 0.61: R82.2 R81.2 37.93,80.36 X24.1
N$75  (via drill 0.35)
  Top 0.61: v78.49,31.54 LED19-Y.K
N$76
  Bottom 0.61: X27.1 37.93,66.14 R85.2 R86.2
N$77
  Bottom 0.61: R88.2 R87.2 59.52,92.94 X28.1
N$78
  Bottom 0.61: R90.2 R89.2 48.73,92.94 X29.1
N$79
  Bottom 0.61: R92.2 R91.2 37.93,92.94 X30.1
N$80
  Bottom 0.61: Q9.3 77.69,29.08 R75.2
N$81
  Bottom 0.61: R96.2 R95.2 48.73,80.36 X32.1
N$82
  Bottom 0.61: X33.1 48.73,66.14 R97.2 R98.2
N$83
  Bottom 0.61: X34.1 59.52,80.36 R99.2 R100.2
N$84
  Bottom 0.61: X35.1 59.52,66.14 R101.2 R102.2
N$85
  Bottom 0.61: Q10.3 78.45,33.27 R76.2
NRST  (via drill 0.35)
  Top 0.305: IC1.7 51.85,42.61 v51.9,42.61 | v64.9,80.01 67.53,82.64 71.25,82.64 S2.A1
  Top 0.61: SL1.5 76.2,87.59 71.25,82.64
  Bottom 0.305: v51.9,42.61 C23.2 54.06,44.83 58.04,44.83 63.37,50.16 63.37,78.49 v64.9,80.01
NSS_5V
  Bottom 0.61: Q1.3 38.59,27.45 R24.2 33.9,27.45 30.48,30.86 IC4.10
PA10  (via drill 0.35)
  Top 0.305: IC1.43 63.88,31.28 63.88,29.72 v64.71,28.89
  Bottom 0.305: v64.71,28.89 65.09,28.89 67.07,26.91 R59.1
PB0
  Top 0.305: IC1.25 47.47,31.37 46.6,31.37 45.64,30.41 45.64,30.03 37.71,22.1 33.4,22.1 26.21,29.29 26.21,29.84 26.21,79.93 33.02,86.74 44.7,86.74 46.23,88.27 X29.2
PB1
  Top 0.305: IC1.26 47.67,30.86 46.99,30.86 46.1,29.97 46.1,29.59 37.72,21.21 33.64,21.21 25.76,29.1 25.76,81.76 32.13,88.14 34.29,88.14 35.43,89.28 X30.2
PB2  (via drill 0.35)
  Top 0.305: IC1.27 47.49,29.97 v47.12,29.97
  Bottom 0.305: v47.12,29.97 47.12,28.82 R65.1
PC1
  Top 0.305: X24.2 35.43,77.22 36.83,75.82 40.13,75.82 41.78,74.17 41.78,62.48 49.2,55.07 49.2,43.84 IC1.9
PC2
  Top 0.305: IC1.10 48.74,43.59 48.74,53.37 42.93,59.18 37.72,59.18 35.43,61.47 X27.2
PC4
  Top 0.305: IC1.24 47.27,31.88 46.35,31.88 44.7,30.23 44.7,29.97 37.72,22.99 33.22,22.99 26.67,29.53 26.67,77.98 33.78,85.09 54.48,85.09 57.02,87.63 X28.2
PC8  (via drill 0.35)
  Top 0.305: IC1.39 60.2,32.14 60.2,26.42 v61.21,25.4
  Bottom 0.305: v61.21,25.4 R63.1
PC9  (via drill 0.35)
  Top 0.305: IC1.40 61.34,31.7 v61.34,26.54
  Bottom 0.305: v61.34,26.54 62.61,25.27 62.61,22.72 R61.1
PC13
  Top 0.305: IC1.2 52.07,45.92 52.07,52.83 53.85,54.61 60.07,54.61 63.5,58.04 63.5,74.04 61.72,75.82 58.42,75.82 57.02,77.22 X34.2
PC14
  Top 0.305: IC1.3 51.61,45.67 51.61,53.66 53.91,55.96 59.76,55.96 61.65,57.85 61.65,60.15 60.2,61.59 58.29,61.59 57.02,62.87 X35.2
PC15  (via drill 0.35)
  Top 0.305: IC1.4 52.11,44.53 51,45.63 51,54.99 54.56,58.55 58.8,58.55 v59.99,57.35 | S1.A1 68.68,69.06 68.68,60.43 63.52,55.27 v62.46,55.27
  Bottom 0.305: v62.46,55.27 62.08,55.27 v59.99,57.35
PH0
  Top 0.305: IC1.5 50.55,45.33 50.55,55.41 52.7,57.57 52.7,74.04 50.93,75.82 47.62,75.82 46.23,77.22 X32.2
PH1
  Top 0.305: X33.2 46.23,62.87 47.5,61.59 49.4,61.59 49.96,61.04 49.96,45.2 IC1.6
SCK_5V
  Bottom 0.61: Q5.3 38.59,38.11 R30.2 36.44,38.11 35.43,39.12 35.43,42.42 38.1,45.09 IC4.13
SCL1  (via drill 0.35)
  Top 0.305: v58.67,46.87 58.67,46.11 IC1.61
  Bottom 0.305: v58.67,46.87 51.43,46.87 50.16,48.13 27.69,48.13 26.29,46.74 26.29,41.4 24.66,39.77 X14.3
SCL2  (via drill 0.35)
  Top 0.305: IC1.28 49.85,31.62 49.85,31.37 38.29,19.81 31.62,19.81 v28.7,22.73
  Bottom 0.305: v28.7,22.73 25.38,26.05 X17.3
SDA1  (via drill 0.35)
  Top 0.305: IC1.62 57.78,45.93 v57.78,48.26
  Bottom 0.305: v57.78,48.26 56.39,49.66 27.3,49.66 25.15,47.5 25.15,43.18 24.24,42.27 X14.2
SDA2
  Top 0.305: IC1.29 50.71,31.78 50.71,31.52 38.36,19.18 30.73,19.18 26.8,23.11 26.8,25.65 23.9,28.55 X17.2
SPI1_MISO  (via drill 0.35)
  Top 0.305: IC1.22 47.76,33.78 v47.37,33.78
  Bottom 0.305: R27.2 44.45,34.56 45.23,33.78 v47.37,33.78
  Bottom 0.61: Q3.2 43.61,34.48 R27.2
SPI1_MOSI  (via drill 0.35)
  Top 0.305: IC1.23 47.58,32.89 v46.48,32.89
  Bottom 0.305: R25.2 44.32,31 44.7,31.38 44.7,32.38 45.21,32.89 v46.48,32.89
  Bottom 0.61: Q2.2 43.61,30.92 R25.2
SPI1_NSS  (via drill 0.35)
  Top 0.305: IC1.20 48,35.43 47.37,35.43 45.58,33.64 v45.58,32.15
  Bottom 0.305: R23.2 44.31,27.45 45.58,28.72 v45.58,32.15
  Bottom 0.61: Q1.2 43.61,27.37 R23.2
SPI1_SCK  (via drill 0.35)
  Top 0.305: IC1.21 48.2,34.92 47.88,34.92 v47.62,34.67
  Bottom 0.305: R29.2 44.2,38.11 47.62,34.69 v47.62,34.67
  Bottom 0.61: Q5.2 43.61,38.03 R29.2
SPI2_MISO  (via drill 0.35)
  Top 0.305: IC1.35 57.66,31.85 57.66,30.73 v57.4,30.48
  Bottom 0.305: v57.4,30.48 57.78,30.86 59.82,30.86 76.45,47.5 76.45,54.61 80.16,58.31 X8.2
SPI2_MOSI  (via drill 0.35)
  Top 0.305: IC1.36 58.29,31.92 v58.29,29.97
  Bottom 0.305: X8.1 80.7,55.81 77.85,52.96 77.85,48.13 59.69,29.97 v58.29,29.97
SPI2_NSS  (via drill 0.35)
  Top 0.305: IC1.33 55.49,31.62 v55.24,31.62
  Bottom 0.305: v55.24,31.62 56.01,32.38 59.82,32.38 73.66,46.23 73.66,58.29 78.68,63.31 X8.4
SPI2_SCK  (via drill 0.35)
  Top 0.305: IC1.34 57.02,31.78 57.02,31.37 56.52,30.86 v56.39,30.86
  Bottom 0.305: v56.39,30.86 57.15,31.62 59.82,31.62 75.06,46.86 75.06,56.39 79.48,60.81 X8.3
SWCLK  (via drill 0.35)
  Top 0.305: IC1.49 61.82,40.77 v62.61,40.77
  Bottom 0.305: v62.61,40.77 61.59,41.78 61.59,46.99 64.9,50.29 64.9,77.6 68.58,81.28 SL1.2
SWDIO  (via drill 0.35)
  Top 0.305: IC1.46 61.6,35.69 v62.1,35.69
  Bottom 0.305: v62.1,35.69 62.36,35.69 64.14,37.47 64.14,41.27 62.99,42.42 62.99,45.72 66.42,49.15 66.42,75.18 73.66,82.42 SL1.4
UART_RX  (via drill 0.35)
  Top 0.305: IC1.54 61.33,43.81 v63.75,43.81
  Bottom 0.305: v63.75,43.81 67.94,48.01 67.94,70.74 81.62,84.42 X11.3
UART_TX  (via drill 0.35)
  Top 0.305: IC1.53 61.28,43.05 64.26,43.05 v64.9,43.69
  Bottom 0.305: v64.9,43.69 69.47,48.26 69.47,68.33 83.06,81.92 X11.2
USART1_RX  (via drill 0.35)
  Top 0.305: IC1.17 47.48,37.42 46.67,38.23 v46.61,38.23 | v28.32,50.67 44.58,50.67 46.86,48.39 v46.86,47.12
  Bottom 0.305: v46.61,38.23 45.97,38.23 44.7,39.5 44.7,42.67 46.86,44.83 v46.86,47.12 | X9.3 13.23,41.93 21.97,50.67 v28.32,50.67
  Bottom 0.61: R57.1 7.38,40.91 8.4,41.93 X9.3
USART1_TX  (via drill 0.35)
  Top 0.305: IC1.16 47.58,39.94 v46.42,39.94 | v48.01,45.97 48.01,49.78 45.85,51.94 v28.32,51.94
  Top 0.61: R55.1 7.38,45.71 8.66,44.43 X9.2
  Bottom 0.305: v28.32,51.94 20.95,51.94 13.44,44.43 X9.2 | v46.42,39.94 46.42,42.99 48.01,44.58 v48.01,45.97
  other vias: 7.38,49.91
USART2_RX  (via drill 0.35)
  Top 0.305: IC1.52 61.48,42.55 65.15,42.55 v65.66,43.05
  Bottom 0.305: v65.66,43.05 70.87,48.26 70.87,64.52 80.22,73.87 X13.3
USART2_TX  (via drill 0.35)
  Top 0.305: IC1.51 61.67,42.04 66.17,42.04 v66.42,42.29
  Bottom 0.305: v66.42,42.29 72.26,48.13 72.26,61.09 82.55,71.37 X13.2
VCAP
  Top 0.305: C20.2 51.56,31.12 51.56,31.92 IC1.30
  Top 0.61: C20.2 C21.2

## Text on the board
tNames: NC | VCC | 3V3 | GND | NRST | ADC1 | SWCLK | SWDIO | 5V | GND | VCC | PB1 | VCC | PB0 | VCC | PC4 | VCC | GND | 3V3 | GND | ADC0 | GND | GND | GND | RX | (PD2) | TX | (PC12) | VCC | VCC | UART | VCC | ADC3 | ADC2 | GND | GND | RESET | RX | (PC11) | GND | PC1 | VCC | GND | PH0 | VCC | GND | VCC | PC13 | TX | (PC10) | VCC | VCC | USART | VCC | ADC5 | ADC4 | GND | GND | USER | NSS | GPIO | SCK | VCC | VCC | PC2 | VCC | PH1 | VCC | VCC | MISO | GND | GND | GND | PC14 | SPI | ADC7 | ADC6 | MOSI | GND | GND | ADC | VCC | TX | TX | VCC | SDA(PB9) | RX | RX | SCL(PB8) | GND | GND | I2C | Wireless / Module | CAN_RX | VCC | SDA(PB11) | 1-B | PC8 | PA10 | SCL(PB10) | F732RET6 | CAN_TX | GND | 1-A | PB2 | PC9 | Sensormain_of_Sawada | ENCODER | 2-B | 2-A | 3-B | 3-A | 4-B | 4-A | 5-B | 5-A | 6-B | 6-A | 5V | 3V3
bNames: 5V | 3V3 | 5V | 3V3 | 5V | 3V3 | 5V | 3V3 | 3V3 | 5V | 5V | 3V3 | 5V | 3V3 | 5V | 3V3 | 5V | 3V3 | 3V3 | 3V3 | 5V | 5V | 5V | 3V3 | 3V3 | 5V | 3V3 | 5V | 3V3 | 5V | 3V3 | 3V3 | 5V | 5V | 3V3 | 3V3 | 5V | 5V | 3V3 | 5V | 3V3 | 5V | 3V3 | 5V